# Altium schematic sheet SVPXFMC_Carrier_6U_SOM.SchDoc: SVPXFMC Carrier 3U
size A3; CheckedBy: \; Author: G.Kasprowicz; CompanyName: ISE; DrawnBy: T.Przywozki; Organization: WUT ISE; Address1: Warsaw University of Technology; Address2: Nowowiejska 15/19 00-665 Warsaw; Revision: 1.0.; SheetNumber: 1; SheetTotal: 20; ModifiedBy: -; CheckedDate: -; Title2: Top; DivGrp: ISE; Designer: G.Kasprowicz; Project: SVPXFMC Carrier 3U; ModifiedDate: -; ProjectName: FMC SFP 4
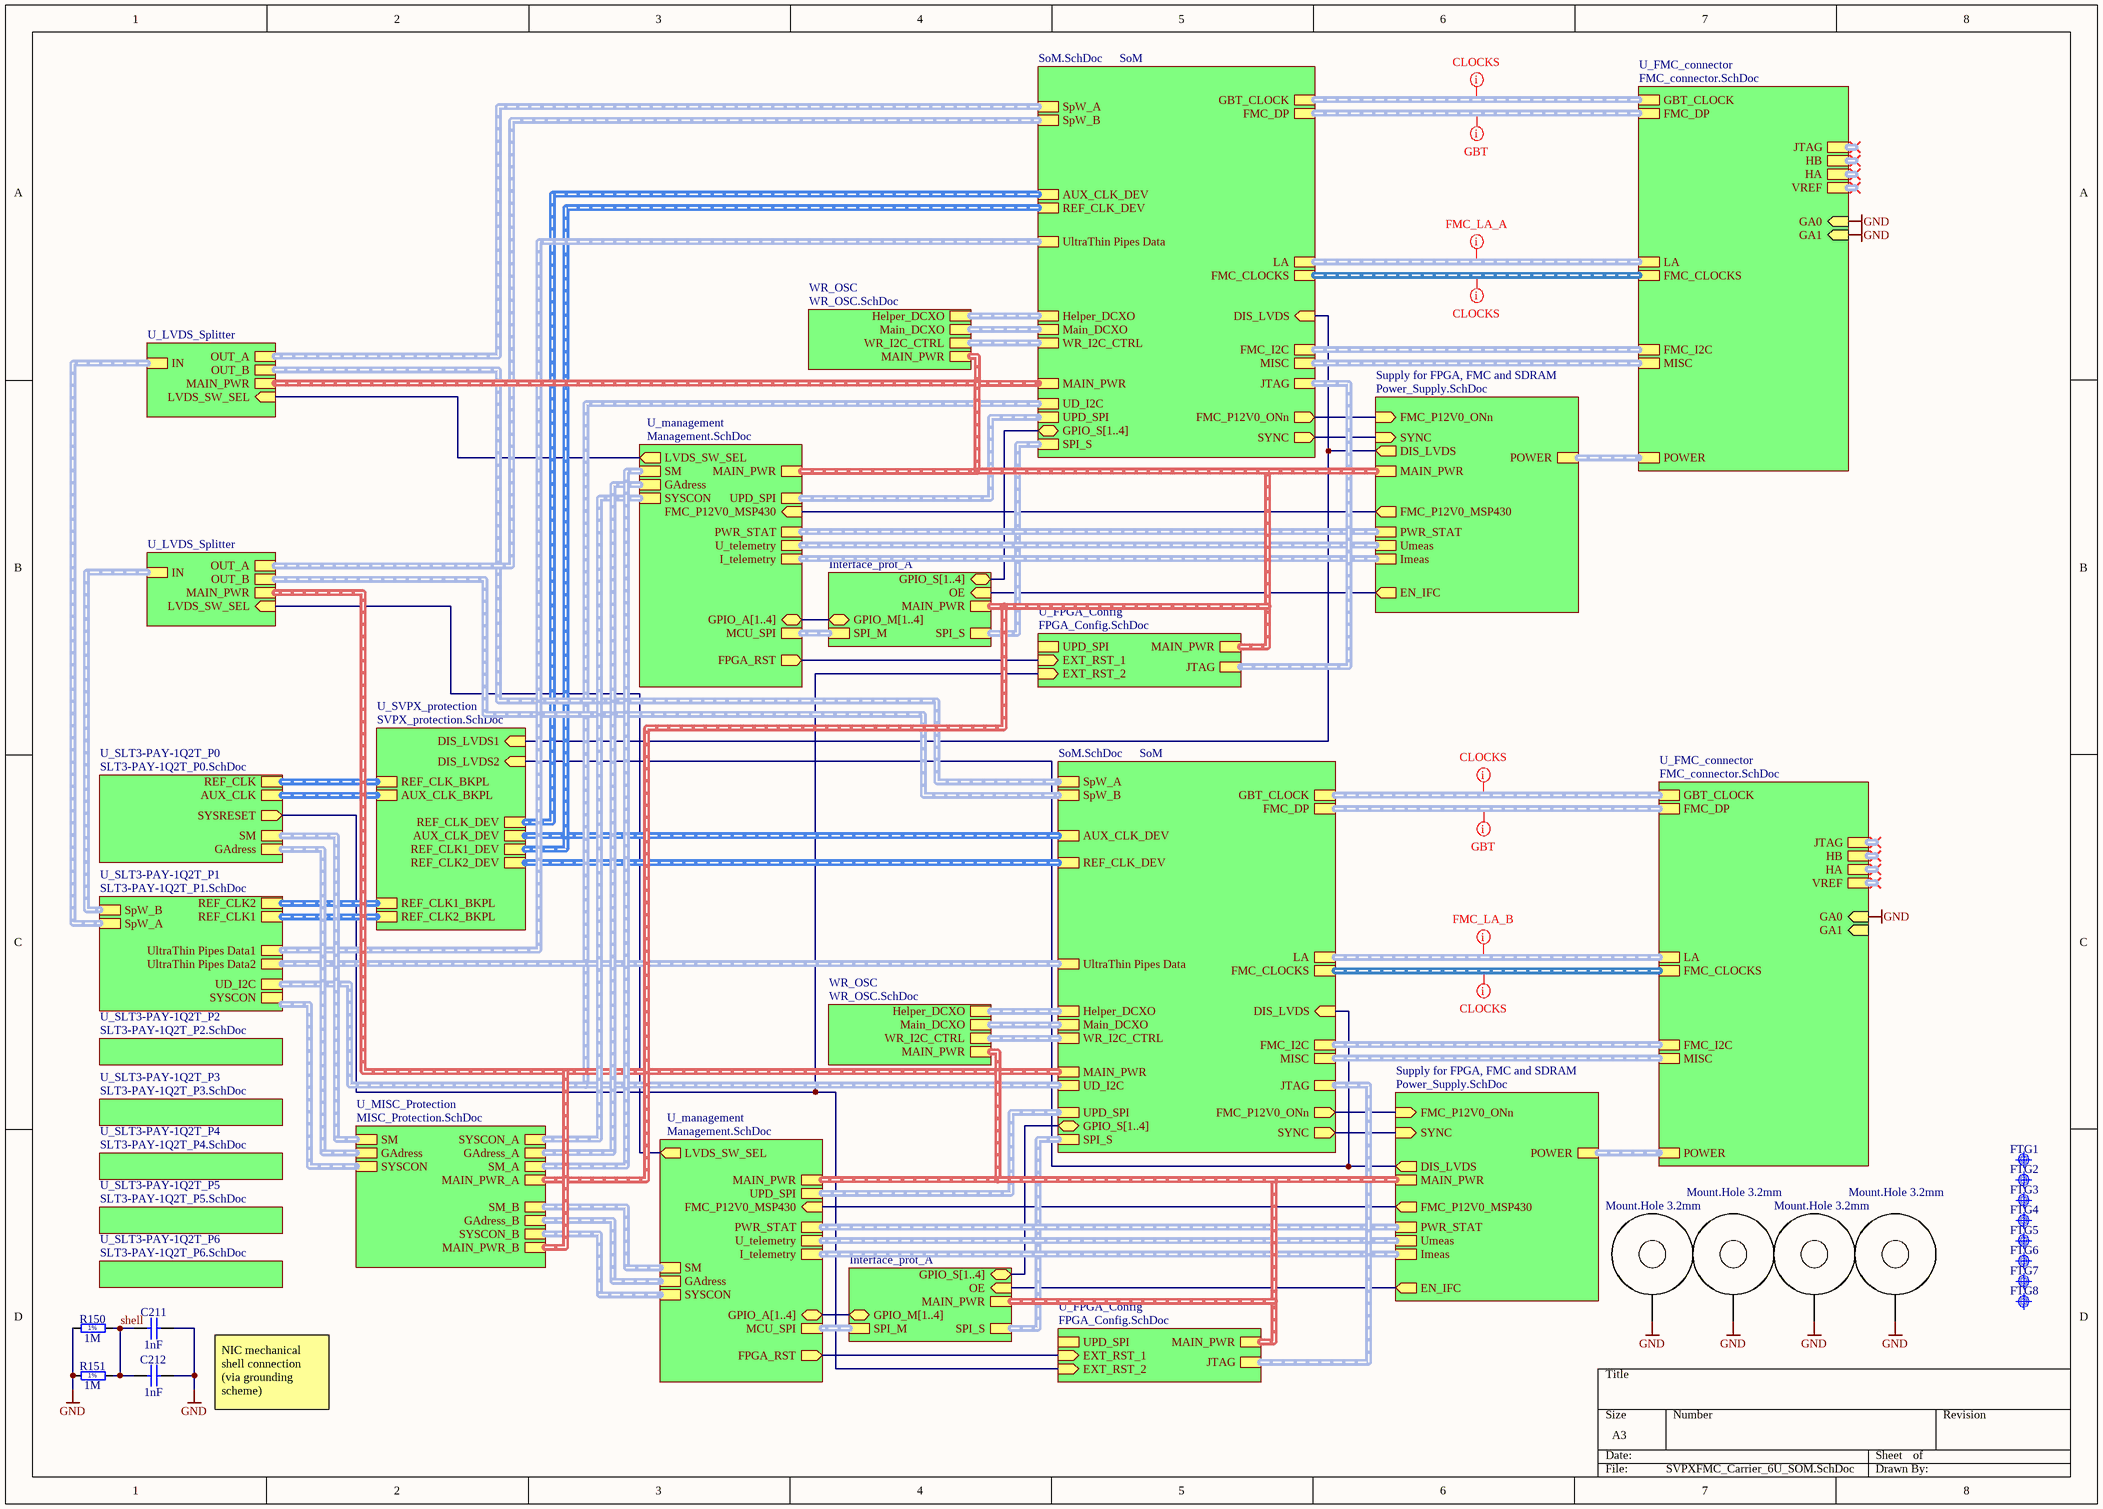
[diagram p0: SVPXFMC_Carrier_6U_SOM.SchDoc]

## Parts
C211  1nF  [CAPC1005X55N]
C212  1nF  [CAPC1005X55N]
FTG1  Use only in PCB  [FIDUCIAL_TOP_C100-200]  (value not drawn)
FTG2  Use only in PCB  [FIDUCIAL_TOP_C100-200]  (value not drawn)
FTG3  Use only in PCB  [FIDUCIAL_TOP_C100-200]  (value not drawn)
FTG4  Use only in PCB  [FIDUCIAL_TOP_C100-200]  (value not drawn)
FTG5  Use only in PCB  [FIDUCIAL_TOP_C100-200]  (value not drawn)
FTG6  Use only in PCB  [FIDUCIAL_TOP_C100-200]  (value not drawn)
FTG7  Use only in PCB  [FIDUCIAL_TOP_C100-200]  (value not drawn)
FTG8  Use only in PCB  [FIDUCIAL_TOP_C100-200]  (value not drawn)
H5  Mount.Hole 3.2mm  [MHole3_2mm]  (no BOM)
H6  Mount.Hole 3.2mm  [MHole3_2mm]  (no BOM)
H7  Mount.Hole 3.2mm  [MHole3_2mm]  (no BOM)
H8  Mount.Hole 3.2mm  [MHole3_2mm]  (no BOM)
R150  1M  [RESC1005X40N]
R151  1M  [RESC1005X40N]

## Sub-sheets
Interface_prot_A = Interface_Protection.SchDoc: SPI_M (harness SPI), SPI_S (harness SPI), OE (in), GPIO_S[1..4] (bidir), GPIO_M[1..4] (bidir), MAIN_PWR (harness MAIN_PWR)
Interface_prot_A = Interface_Protection.SchDoc: SPI_M (harness SPI), SPI_S (harness SPI), OE (in), GPIO_S[1..4] (bidir), GPIO_M[1..4] (bidir), MAIN_PWR (harness MAIN_PWR)
SoM = SoM.SchDoc: REF_CLK_DEV (harness CLK), WR_I2C_CTRL (harness WR_I2C_CTRL), Main_DCXO (harness DIFF_CLK), Helper_DCXO (harness DIFF_CLK), GPIO_S[1..4] (bidir), SPI_S (harness SPI), FMC_P12V0_ONn (out), SYNC (out), DIS_LVDS (in), UltraThin Pipes Data (harness UTP_Data), LA (harness FMC_J1_LA), MISC (harness MISC), FMC_I2C (harness I2C), FMC_CLOCKS (harness FMC_CLOCKS), SpW_A (harness SpW), SpW_B (harness SpW), UPD_SPI (harness UPD_SPI), UD_I2C (harness I2C), MAIN_PWR (harness MAIN_PWR), GBT_CLOCK (harness GBT_CLOCK), FMC_DP (harness FMC_DP), AUX_CLK_DEV (harness CLK), JTAG (harness JTAG)
SoM = SoM.SchDoc: REF_CLK_DEV (harness CLK), WR_I2C_CTRL (harness WR_I2C_CTRL), Main_DCXO (harness DIFF_CLK), Helper_DCXO (harness DIFF_CLK), GPIO_S[1..4] (bidir), SPI_S (harness SPI), FMC_P12V0_ONn (out), SYNC (out), DIS_LVDS (in), UltraThin Pipes Data (harness UTP_Data), LA (harness FMC_J1_LA), MISC (harness MISC), FMC_I2C (harness I2C), FMC_CLOCKS (harness FMC_CLOCKS), SpW_A (harness SpW), SpW_B (harness SpW), UPD_SPI (harness UPD_SPI), UD_I2C (harness I2C), FMC_DP (harness FMC_DP), AUX_CLK_DEV (harness CLK), GBT_CLOCK (harness GBT_CLOCK), MAIN_PWR (harness MAIN_PWR), JTAG (harness JTAG)
Supply for FPGA, FMC and SDRAM = Power_Supply.SchDoc: Imeas (harness Imeas), SYNC (in), POWER (harness FMC_POWER), FMC_P12V0_ONn (in), PWR_STAT (harness PWR_STAT), Umeas (harness Umeas), DIS_LVDS (out), EN_IFC (out), FMC_P12V0_MSP430 (out), MAIN_PWR (harness MAIN_PWR)
Supply for FPGA, FMC and SDRAM = Power_Supply.SchDoc: Imeas (harness Imeas), SYNC (in), POWER (harness FMC_POWER), FMC_P12V0_ONn (in), PWR_STAT (harness PWR_STAT), Umeas (harness Umeas), DIS_LVDS (out), EN_IFC (out), FMC_P12V0_MSP430 (out), MAIN_PWR (harness MAIN_PWR)
U_FMC_connector = FMC_connector.SchDoc: LA (harness FMC_J1_LA), HA (harness FMC_J1_HA), HB (harness FMC_J1_HB), MISC (harness MISC), POWER (harness FMC_POWER), JTAG (harness FMC_J1_JTAG), FMC_I2C (harness I2C), FMC_CLOCKS (harness FMC_CLOCKS), VREF (harness FMC_J1_VREF), GA0 (in), GA1 (in), GBT_CLOCK (harness GBT_CLOCK), FMC_DP (harness FMC_DP)
U_FMC_connector = FMC_connector.SchDoc: LA (harness FMC_J1_LA), HA (harness FMC_J1_HA), HB (harness FMC_J1_HB), MISC (harness MISC), POWER (harness FMC_POWER), JTAG (harness FMC_J1_JTAG), FMC_I2C (harness I2C), FMC_CLOCKS (harness FMC_CLOCKS), VREF (harness FMC_J1_VREF), GA0 (in), GA1 (in), GBT_CLOCK (harness GBT_CLOCK), FMC_DP (harness FMC_DP)
U_FPGA_Config = FPGA_Config.SchDoc: UPD_SPI (harness UPD_SPI), EXT_RST_1 (in), EXT_RST_2 (in), MAIN_PWR (harness MAIN_PWR), JTAG (harness JTAG)
U_FPGA_Config = FPGA_Config.SchDoc: UPD_SPI (harness UPD_SPI), EXT_RST_1 (in), EXT_RST_2 (in), MAIN_PWR (harness MAIN_PWR), JTAG (harness JTAG)
U_LVDS_Splitter = LVDS_Splitter.SchDoc: MAIN_PWR (harness MAIN_PWR), LVDS_SW_SEL (in), IN (harness SpW), OUT_B (harness SpW), OUT_A (harness SpW)
U_LVDS_Splitter = LVDS_Splitter.SchDoc: LVDS_SW_SEL (in), MAIN_PWR (harness MAIN_PWR), IN (harness SpW), OUT_B (harness SpW), OUT_A (harness SpW)
U_management = Management.SchDoc: MCU_SPI (harness SPI), SM (harness SM), GAdress (harness GAdress), U_telemetry (harness Umeas), I_telemetry (harness Imeas), FPGA_RST (out), UPD_SPI (harness UPD_SPI), SYSCON (harness SYSCON), PWR_STAT (harness PWR_STAT), GPIO_A[1..4] (bidir), FMC_P12V0_MSP430 (in), MAIN_PWR (harness MAIN_PWR), LVDS_SW_SEL (out)
U_management = Management.SchDoc: MCU_SPI (harness SPI), SM (harness SM), GAdress (harness GAdress), U_telemetry (harness Umeas), I_telemetry (harness Imeas), FPGA_RST (out), UPD_SPI (harness UPD_SPI), SYSCON (harness SYSCON), PWR_STAT (harness PWR_STAT), GPIO_A[1..4] (bidir), FMC_P12V0_MSP430 (in), MAIN_PWR (harness MAIN_PWR), LVDS_SW_SEL (out)
U_MISC_Protection = MISC_Protection.SchDoc: SYSCON (harness SYSCON), GAdress (harness GAdress), SM (harness SM), SYSCON_A (harness SYSCON), GAdress_A (harness GAdress), SM_A (harness SM), SYSCON_B (harness SYSCON), GAdress_B (harness GAdress), SM_B (harness SM), MAIN_PWR_A (harness MAIN_PWR), MAIN_PWR_B (harness MAIN_PWR)
U_SLT3-PAY-1Q2T_P0 = SLT3-PAY-1Q2T_P0.SchDoc: AUX_CLK (harness CLK), REF_CLK (harness CLK), GAdress (harness GAdress), SM (harness SM), SYSRESET (out)
U_SLT3-PAY-1Q2T_P1 = SLT3-PAY-1Q2T_P1.SchDoc: REF_CLK1 (harness CLK), REF_CLK2 (harness CLK), SYSCON (harness SYSCON), UD_I2C (harness I2C), UltraThin Pipes Data2 (harness UTP_Data), UltraThin Pipes Data1 (harness UTP_Data), SpW_B (harness SpW), SpW_A (harness SpW)
U_SLT3-PAY-1Q2T_P2 = SLT3-PAY-1Q2T_P2.SchDoc: no entries
U_SLT3-PAY-1Q2T_P3 = SLT3-PAY-1Q2T_P3.SchDoc: no entries
U_SLT3-PAY-1Q2T_P4 = SLT3-PAY-1Q2T_P4.SchDoc: no entries
U_SLT3-PAY-1Q2T_P5 = SLT3-PAY-1Q2T_P5.SchDoc: no entries
U_SLT3-PAY-1Q2T_P6 = SLT3-PAY-1Q2T_P6.SchDoc: no entries
U_SVPX_protection = SVPX_protection.SchDoc: REF_CLK_BKPL (harness CLK), AUX_CLK_BKPL (harness CLK), AUX_CLK_DEV (harness CLK), REF_CLK_DEV (harness CLK), REF_CLK1_BKPL (harness CLK), REF_CLK2_BKPL (harness CLK), REF_CLK1_DEV (harness CLK), REF_CLK2_DEV (harness CLK), DIS_LVDS1 (in), DIS_LVDS2 (in)
WR_OSC = WR_OSC.SchDoc: WR_I2C_CTRL (harness WR_I2C_CTRL), Main_DCXO (harness DIFF_CLK), Helper_DCXO (harness DIFF_CLK), MAIN_PWR (harness MAIN_PWR)
WR_OSC = WR_OSC.SchDoc: WR_I2C_CTRL (harness WR_I2C_CTRL), Main_DCXO (harness DIFF_CLK), Helper_DCXO (harness DIFF_CLK), MAIN_PWR (harness MAIN_PWR)

## Nets
GND: C211.2 C212.2 H5.1 H6.1 H7.1 H8.1 R150.1 R151.1 ; sheet U_FMC_connector/GA0, sheet U_FMC_connector/GA0, sheet U_FMC_connector/GA1
shell: C211.1 C212.1 R150.2 R151.2
(unnamed): sheet Interface_prot_A/OE, sheet Supply for FPGA, FMC and SDRAM/EN_IFC
(unnamed): sheet Supply for FPGA, FMC and SDRAM/SYNC, sheet SoM/SYNC
(unnamed): sheet Supply for FPGA, FMC and SDRAM/FMC_P12V0_ONn, sheet SoM/FMC_P12V0_ONn
(unnamed): sheet Supply for FPGA, FMC and SDRAM/DIS_LVDS, sheet U_SVPX_protection/DIS_LVDS2, sheet SoM/DIS_LVDS
(unnamed): sheet Supply for FPGA, FMC and SDRAM/FMC_P12V0_MSP430, sheet U_management/FMC_P12V0_MSP430
(unnamed): sheet U_SLT3-PAY-1Q2T_P0/SYSRESET, sheet U_FPGA_Config/EXT_RST_2, sheet U_FPGA_Config/EXT_RST_2
(unnamed): sheet U_management/FPGA_RST, sheet U_FPGA_Config/EXT_RST_1
(unnamed): sheet U_management/LVDS_SW_SEL, sheet U_LVDS_Splitter/LVDS_SW_SEL
(unnamed): sheet U_SVPX_protection/DIS_LVDS1, sheet Supply for FPGA, FMC and SDRAM/DIS_LVDS, sheet SoM/DIS_LVDS
(unnamed): sheet Interface_prot_A/OE, sheet Supply for FPGA, FMC and SDRAM/EN_IFC
(unnamed): sheet Supply for FPGA, FMC and SDRAM/SYNC, sheet SoM/SYNC
(unnamed): sheet Supply for FPGA, FMC and SDRAM/FMC_P12V0_ONn, sheet SoM/FMC_P12V0_ONn
(unnamed): sheet Supply for FPGA, FMC and SDRAM/FMC_P12V0_MSP430, sheet U_management/FMC_P12V0_MSP430
(unnamed): sheet U_management/FPGA_RST, sheet U_FPGA_Config/EXT_RST_1
(unnamed): sheet U_management/LVDS_SW_SEL, sheet U_LVDS_Splitter/LVDS_SW_SEL

## Buses and harness runs
bus sheet Interface_prot_A/GPIO_M[1..4] = sheet U_management/GPIO_A[1..4]
bus sheet Interface_prot_A/GPIO_S[1..4] = sheet SoM/GPIO_S[1..4]
harness sheet Interface_prot_A/MAIN_PWR = sheet SoM/MAIN_PWR = sheet Supply for FPGA, FMC and SDRAM/MAIN_PWR = sheet U_FPGA_Config/MAIN_PWR = sheet U_LVDS_Splitter/MAIN_PWR = sheet U_management/MAIN_PWR = sheet U_MISC_Protection/MAIN_PWR_A = sheet WR_OSC/MAIN_PWR
harness sheet Interface_prot_A/MAIN_PWR = sheet SoM/MAIN_PWR = sheet Supply for FPGA, FMC and SDRAM/MAIN_PWR = sheet U_FPGA_Config/MAIN_PWR = sheet U_LVDS_Splitter/MAIN_PWR = sheet U_management/MAIN_PWR = sheet U_MISC_Protection/MAIN_PWR_B = sheet WR_OSC/MAIN_PWR
harness sheet Interface_prot_A/SPI_M = sheet U_management/MCU_SPI
harness sheet Interface_prot_A/SPI_S = sheet SoM/SPI_S
harness sheet SoM/AUX_CLK_DEV = sheet U_SVPX_protection/AUX_CLK_DEV
harness sheet SoM/AUX_CLK_DEV = sheet U_SVPX_protection/REF_CLK_DEV
harness sheet SoM/FMC_CLOCKS = sheet U_FMC_connector/FMC_CLOCKS
harness sheet SoM/FMC_DP = sheet U_FMC_connector/FMC_DP
harness sheet SoM/FMC_I2C = sheet U_FMC_connector/FMC_I2C
harness sheet SoM/GBT_CLOCK = sheet U_FMC_connector/GBT_CLOCK
harness sheet SoM/Helper_DCXO = sheet WR_OSC/Helper_DCXO
harness sheet SoM/JTAG = sheet U_FPGA_Config/JTAG
harness sheet SoM/LA = sheet U_FMC_connector/LA
harness sheet SoM/Main_DCXO = sheet WR_OSC/Main_DCXO
harness sheet SoM/MISC = sheet U_FMC_connector/MISC
harness sheet SoM/REF_CLK_DEV = sheet U_SVPX_protection/REF_CLK1_DEV
harness sheet SoM/REF_CLK_DEV = sheet U_SVPX_protection/REF_CLK2_DEV
harness sheet SoM/SpW_A = sheet U_LVDS_Splitter/OUT_A
harness sheet SoM/SpW_A = sheet U_LVDS_Splitter/OUT_B
harness sheet SoM/SpW_B = sheet U_LVDS_Splitter/OUT_A
harness sheet SoM/SpW_B = sheet U_LVDS_Splitter/OUT_B
harness sheet SoM/UD_I2C = sheet U_SLT3-PAY-1Q2T_P1/UD_I2C
harness sheet SoM/UltraThin Pipes Data = sheet U_SLT3-PAY-1Q2T_P1/UltraThin Pipes Data1
harness sheet SoM/UltraThin Pipes Data = sheet U_SLT3-PAY-1Q2T_P1/UltraThin Pipes Data2
harness sheet SoM/UPD_SPI = sheet U_management/UPD_SPI
harness sheet SoM/WR_I2C_CTRL = sheet WR_OSC/WR_I2C_CTRL
harness sheet Supply for FPGA, FMC and SDRAM/Imeas = sheet U_management/I_telemetry
harness sheet Supply for FPGA, FMC and SDRAM/POWER = sheet U_FMC_connector/POWER
harness sheet Supply for FPGA, FMC and SDRAM/PWR_STAT = sheet U_management/PWR_STAT
harness sheet Supply for FPGA, FMC and SDRAM/Umeas = sheet U_management/U_telemetry
harness sheet U_LVDS_Splitter/IN = sheet U_SLT3-PAY-1Q2T_P1/SpW_A
harness sheet U_LVDS_Splitter/IN = sheet U_SLT3-PAY-1Q2T_P1/SpW_B
harness sheet U_management/GAdress = sheet U_MISC_Protection/GAdress_A
harness sheet U_management/GAdress = sheet U_MISC_Protection/GAdress_B
harness sheet U_management/SM = sheet U_MISC_Protection/SM_A
harness sheet U_management/SM = sheet U_MISC_Protection/SM_B
harness sheet U_management/SYSCON = sheet U_MISC_Protection/SYSCON_A
harness sheet U_management/SYSCON = sheet U_MISC_Protection/SYSCON_B
harness sheet U_MISC_Protection/GAdress = sheet U_SLT3-PAY-1Q2T_P0/GAdress
harness sheet U_MISC_Protection/SM = sheet U_SLT3-PAY-1Q2T_P0/SM
harness sheet U_SLT3-PAY-1Q2T_P0/AUX_CLK = sheet U_SVPX_protection/AUX_CLK_BKPL
harness sheet U_SLT3-PAY-1Q2T_P0/REF_CLK = sheet U_SVPX_protection/REF_CLK_BKPL
harness sheet U_SLT3-PAY-1Q2T_P1/REF_CLK1 = sheet U_SVPX_protection/REF_CLK2_BKPL
harness sheet U_SLT3-PAY-1Q2T_P1/REF_CLK2 = sheet U_SVPX_protection/REF_CLK1_BKPL

## Layout directives
net class FMC_LA_A: (no net found under the mark)
net class GBT; rule Differential Pairs Routing [Pref Gap = 4.33mil    Min Gap  = 4.291mil    Max Gap  = 5milPref Width = 3.385mil    Min Width  = 3.385mil    Max Width  = 7.086mil]: (no net found under the mark)
net class FMC_LA_B: (no net found under the mark)
net class FMC_CLKs: (no net found under the mark)

## Notes on the sheet
- NIC mechanical shell connection (via grounding scheme)
- Title
- Size:
- Date:
- A3
- Number:
- Time:
- Revision:
- Sheet
- of
- File:
- (in symbol R0402_1M_1%_0.0625W_100PPM) 1%

## Library data of the parts
C211 C212 = CC0402_1NF_50V_10%_X7R: Non-polarised capacitor; Part Description: SMD Multilayer Chip Ceramic Capacitor; Manufacturer: GENERIC; Manufacturer1 Part Number: 223858715623; Voltage: 50V; TC: X7R; Tolerance: ±10%; Part Number: CC0402_1NF_50V_10%_X7R; Component Kind: Standard; Component Type: Standard; Pin Count: 2; Value: 1nF; Status: Not Recommended; Manufacturer Part Number: CC0402_1NF_50V_10%_X7R; Case: 0402; Mounted: Yes; Socket: No; SMD: Yes; Sense: No; Manufacturer1 Example: PHYCOMP; Manufacturer1 ComponentHeight: 0.55mm; HelpURL: \\cern.ch\dfs\Applications\Altium\Datasheets\CC0402_X7R_PHYCOMP.pdf; Author: CERN DEM JLC; CreateDate: 03.12.2007; LatestRevisionDate: 03.12.2007
FTG1-FTG8 = FIDUCIAL_TARGET_C100-200: Fiducial Target; Part Description: Round Fiducial Target, Top Layer, 1.0mm, Top Solder 2.0mm, Keepout =2.0mm; Mounted: No; Part Number: FIDUCIAL_TARGET_C100-200; Component Kind: Standard (No BOM); Component Type: Standard (No BOM); Pin Count: 1; Family: Fiducial; Socket: No; SMD: Yes; Sense: No; Status: None; ComponentHeight: 0mm; HelpURL: Undefined; Author: CERN DEM JLC; CreateDate: 09.02.2010; LatestRevisionDate: 04.04.2012; PackageDescription: Round Fiducial Target, Top Layer, 1.0mm, Top Solder 2.0mm, Keepout =2.0mm
H5-H8 = 22898: AN: 22898; Mixed: THT
R150 R151 = R0402_1M_1%_0.0625W_100PPM: Resistor - 1%; Part Description: General Purpose Thick Film Chip Resistor; Manufacturer: GENERIC; Manufacturer1 Part Number: 232270671005L; TC: ±100ppm/°C; PressFit: No; Part Number: R0402_1M_1%_0.0625W_100PPM; Component Kind: Standard; Component Type: Standard; Pin Count: 2; Value: 1M; Status: Not Recommended; Power: 0.0625W; Tolerance: ±1%; Manufacturer Part Number: R0402_1M_1%_0.0625W_100PPM; Case: 0402; Mounted: Yes; Sense: No; Socket: No; SMD: Yes; Manufacturer1 Example: YAGEO PHYCOMP; Manufacturer1 ComponentHeight: 0.4mm; HelpURL: \\cern.ch\dfs\Applications\Altium\Datasheets\R0402_Phycomp_RC0402.pdf; Author: CERN DEM JLC; CreateDate: 03.12.2007; LatestRevisionDate: 17.10.2012